# EAGLE design leslius (EAGLE 8.5.1)
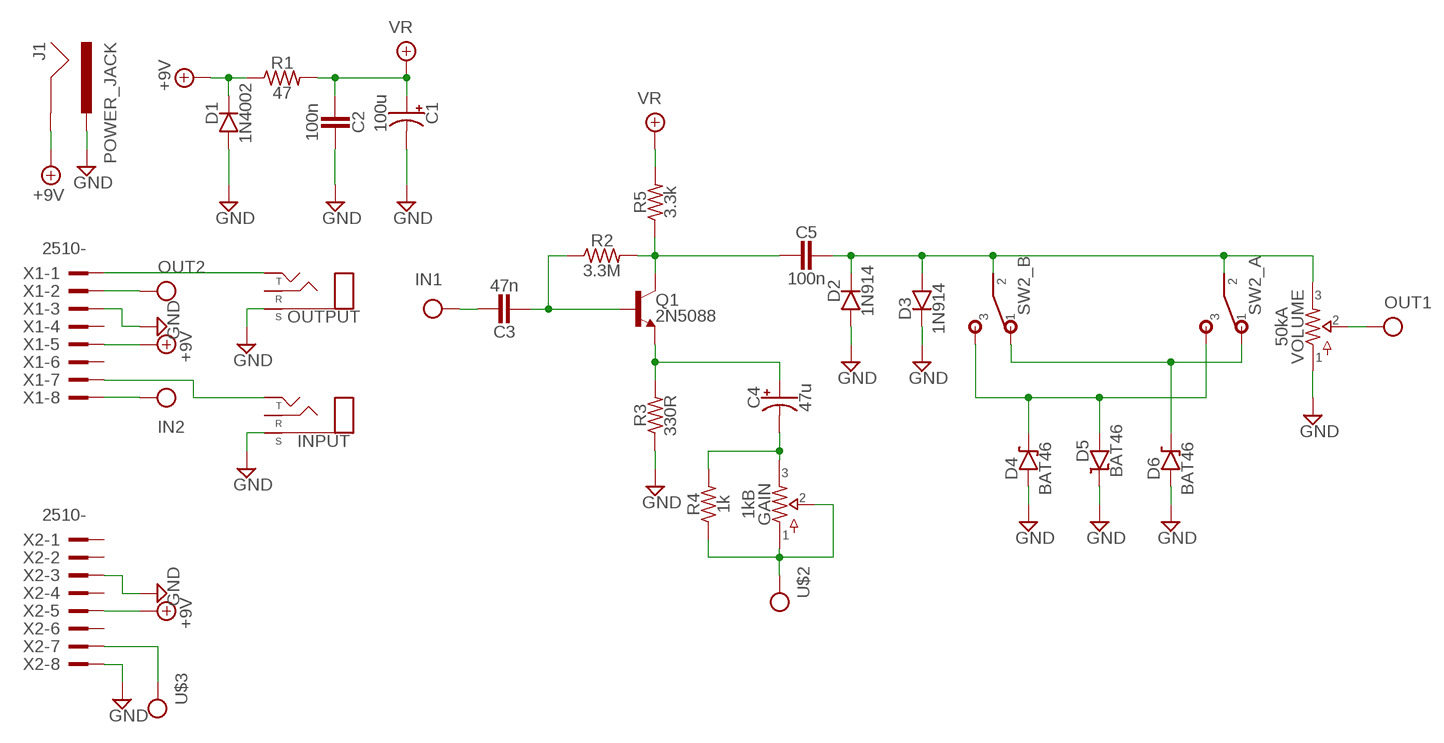
[diagram p0: schematic, sheet 1]

## Parts
C1  100u  0400  [040_020]
C2  100n  CER/FILM2  [050X030_025_2]
C3  47n  CER/FILMBOX.1  [BOX_SMALL]
C4  47u  0400  [040_020]
C5  100n  CER/FILMBOX.1  [BOX_SMALL]
D1  1N4002  DO41.2  [DO41-2]
D2  1N914  DO35.2  [DO35-2]
D3  1N914  DO35.2  [DO35-2]
D4  BAT46  ZENER.2  [DO41-2]
D5  BAT46  ZENER.2  [DO41-2]
D6  BAT46  ZENER.2  [DO41-2]
GAIN  1kB  POTS16MM  [16MM]
INPUT  STEREONMJ  [NMJ6HCD2]
J1  POWER_JACK  [POWER_JACK_PTH]
OUTPUT  STEREONMJ  [NMJ6HCD2]
Q1  2N5088  [TO92-]
R1  47  R_.3B  [R0207/3]
R2  3.3M  R_.3B  [R0207/3]
R3  330R  R_.3B  [R0207/3]
R4  1k  R_.3B  [R0207/3]
R5  3.3k  R_.3B  [R0207/3]
SW2  DPDT  [DPDT]
VOLUME  50kA  POTS16MM  [16MM]
X1  2510-  [PAK100/2500-10]
X2  2510-  [PAK100/2500-10]

## Nets
+9V: D1.C J1.GND R1.1 X1.5 X2.5
GND: C1.- C2.1 D1.A D2.A D3.C D4.A D5.C D6.A INPUT.S J1.PWR OUTPUT.S R3.1 VOLUME.1 X1.3 X2.3 X2.8
IN: C3.1 X1.8
N$1: C3.2 Q1.2(B) R2.1
N$2: INPUT.T X1.7
N$3: C5.1 Q1.1(C) R2.2 R5.1
N$4: OUTPUT.T X1.1
N$5: C4.+ Q1.3(E) R3.2
N$6: C4.- GAIN.3 R4.2
N$7: D6.C SW2.A1 SW2.B1
N$9: D4.C D5.A SW2.A3 SW2.B3
N$10: C5.2 D2.C D3.A SW2.A2 SW2.B2 VOLUME.3
OUT: VOLUME.2 X1.2
SND: GAIN.1 GAIN.2 R4.1 X2.7
VR: C1.+ C2.2 R1.2 R5.2
Unconnected: INPUT.R OUTPUT.R X1.4 X1.6 X2.1 X2.2 X2.4 X2.6

## Library data of the parts
C1 C4 = pedals-capacitors-elec:040
C2 C3 C5 = pedals-capacitors-film:CER/FILM: 47 - 120pF Xicon Ceramic Disc 2.5mm lead spacing
D1 = pedals-diodes:DO41: DO-41 Package Diodes: 1N4001 - 1N40019 Zener Diodes: 1N4728 - 1N4764
D2 D3 = pedals-diodes:DO35: DO-35 Package Diodes: 1N914
D4-D6 = pedals-diodes:ZENER
GAIN VOLUME = pedals-potentiometers:POTS
INPUT OUTPUT = pedals-jacks:STEREO
J1 = pedals-jacks:POWER_JACK: Power Jack Connector This is the standard 5.5mm barrel jack for power. The PTH is the most common, proven, reliable, footprint. The Slot footprint only works if the mill layer is transmitted to the PCB fab house so be warned. Here are the connectors we sell at SparkFun: DC Barrel Power Jack/Connector <https://www.sparkfun.com/products/119> (PRT-00119) DC Barrel Power Jack/Connector (SMD) <https://www.sparkfun.com/products/12748> (PRT-12748) DC Barrel Jack Adapter - Breadboard Compatible <https://www.sparkfun.com/products/10811> (PRT-10811) It is used on this SparkFun product (and many, many others): SparkFun RedBoard - Programmed with Arduino <https://www.sparkfun.com/products/12757> (DEV-12757) Also, if you need a mating power supply or connector, please check these out: Wall Adapter Power Supply - 9VDC 650mA <https://www.sparkfun.com/products/298> (TOL-00298) DC Barrel Jack Adapter - Male <https://www.sparkfun.com/products/10287> (PRT-10287); PROD_ID: CONN-08197
Q1 = pedals-transistors:2N5088: NPN Transistor
R1-R5 = pedals-resistors:R_
SW2 = pedals-switches:DPDT
X1 X2 = pedals-headers:2510-: 3M (TM) Pak 100 4-Wall Header Source: 3M; MF: 3M; MPN: 2510-6002UB; OC_FARNELL: 9838244; OC_NEWARK: 46F4725

## Board
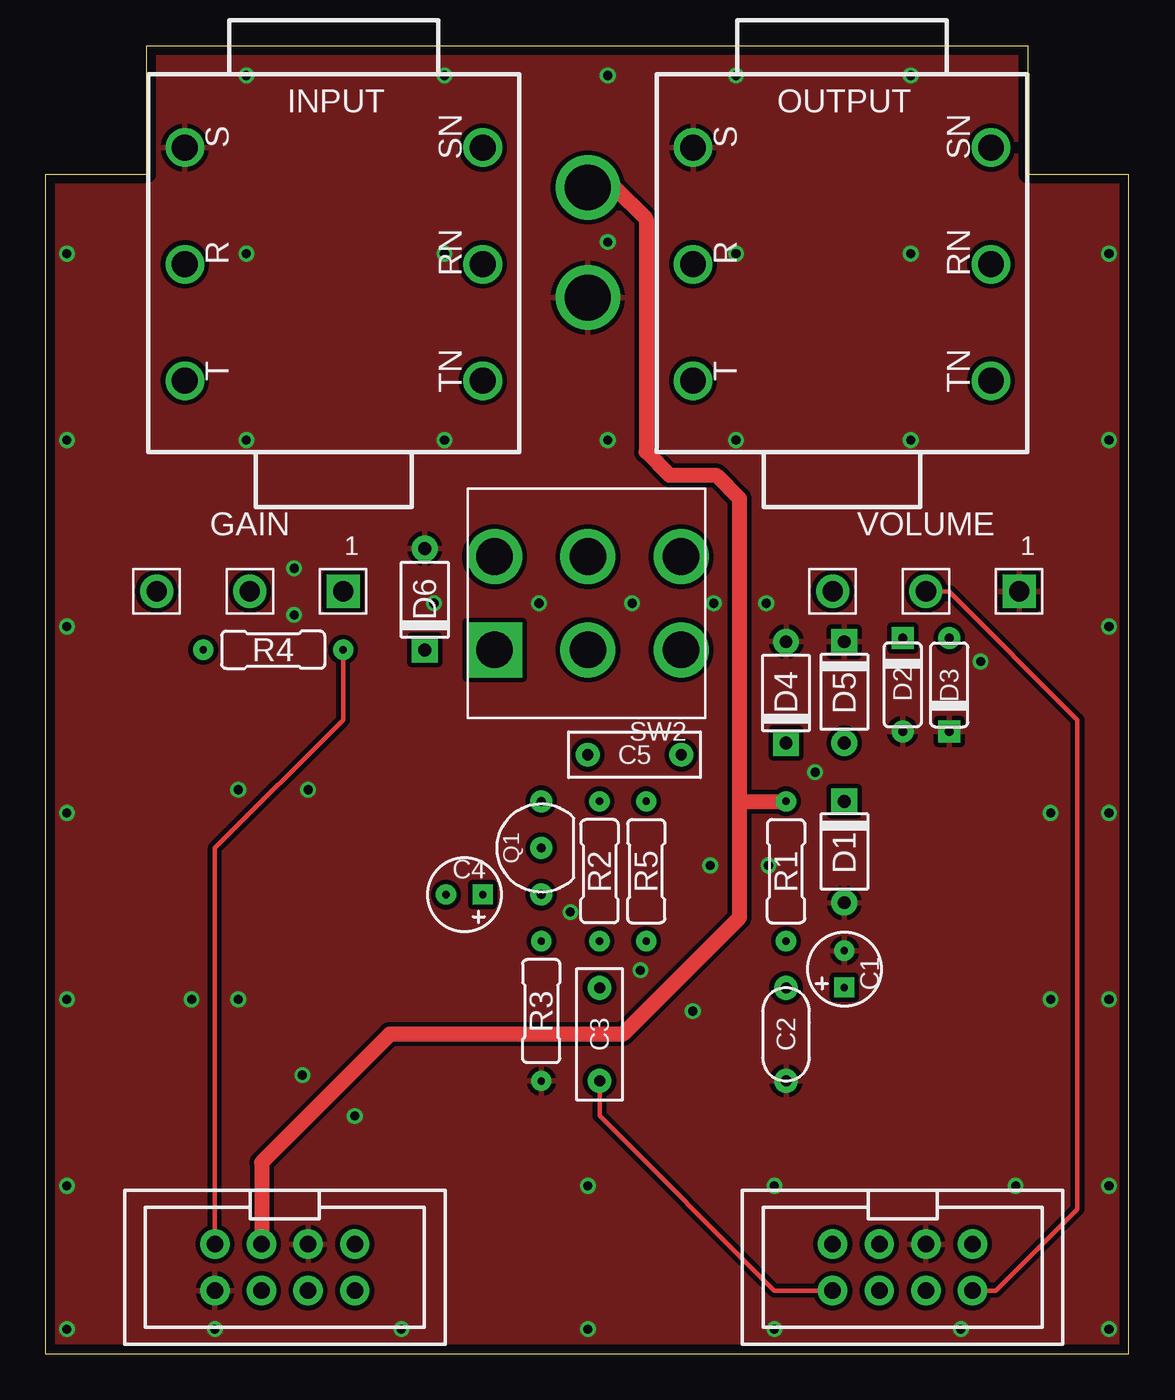
[diagram p1: board, top side]
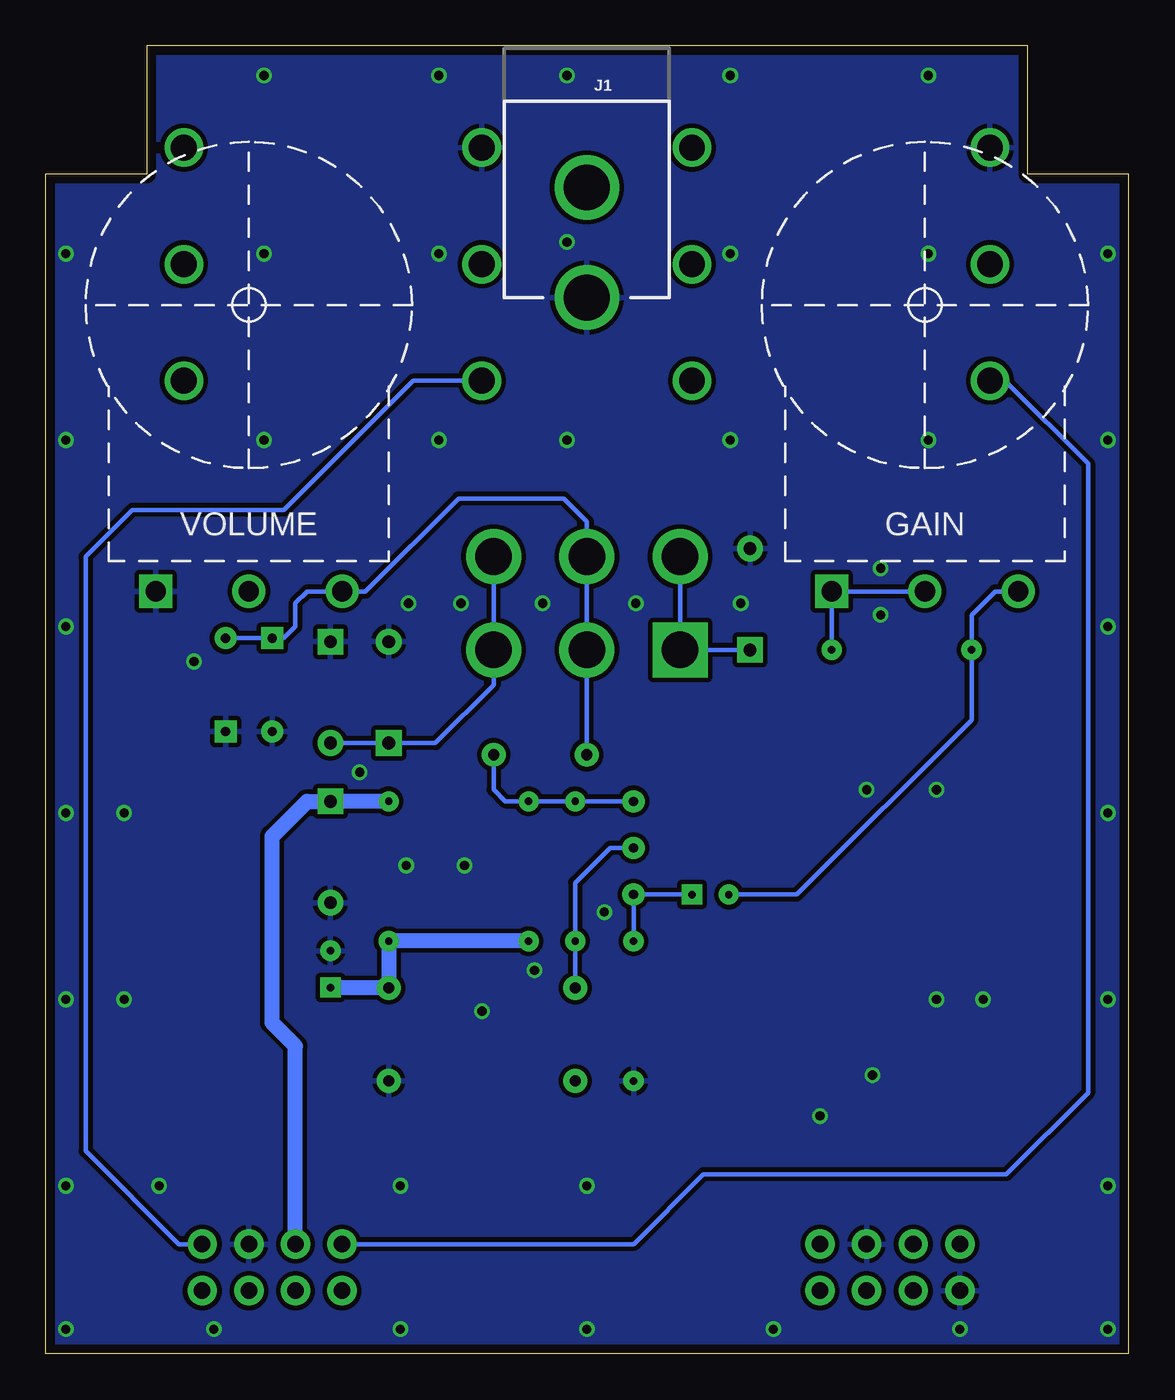
[diagram p2: board, bottom side, seen from below]

Size 59 x 71.27 mm. Coordinates in mm from the lower left corner, seen from the top.
Copper layers (1*16): Top 0.035mm / dielectric 1.6mm / Bottom 0.035mm
Design rules "Elecrow_2-layer_PCB_eagle_rule": minimum track width 6mil, minimum drill 12mil, track to track 6mil, track to pad 6mil, pad to pad 6mil, via to via 8mil, smd to smd 0mil, copper to edge 20mil, drill to drill 10mil, minimum pad ring 6mil, minimum via ring 6mil, stop-mask expansion 0mil, vias tented up to drill 100mil, thermal gap 10mil

### Footprints (pad centres in the part's own frame; a part is rotated, then mirrored left to right if it is on the bottom)
040_020 = drill 0.4 pad 1.1 square: + -1.001,0 | drill 0.4 pad 1.1: - 1.001,0
050X030_025_2 = drill 0.6 pad 1.3: 1 -2.54,0; 2 2.54,0
BOX_SMALL = drill 0.6 pad 1.3: 1 -2.54,0; 2 2.54,0
DO41-2 = drill 0.7 pad 1.4: A 2.794,0 | drill 0.7 pad 1.4 square: C -2.731,0
DO35-2 = drill 0.5 pad 1.2: A 2.54,0 | drill 0.5 pad 1.2 square: C -2.54,0
16MM = drill 1.1 pad 1.8 square: 1 5.08,-1 | drill 1.1 pad 1.8: 2 0,-1; 3 -5.08,-1
NMJ6HCD2 = drill 1.4: R 0,8.115; RN 0,-8.115; S 6.35,8.115; SN 6.35,-8.115; T -6.35,8.115; TN -6.35,-8.115
POWER_JACK_PTH = drill 2.5: GND 0,7.7; PWR 0,13.7
TO92- = drill 0.5 pad 1.2: 1 2.54,0; 2 0,0; 3 -2.54,0
R0207/3 = drill 0.4 pad 1.1: 1 -3.81,0; 2 3.81,0
DPDT = drill 2 pad 2.7 square: A1 -2.54,5.08 | drill 2 pad 2.7: A2 -2.54,0; A3 -2.54,-5.08; B1 2.54,5.08; B2 2.54,0; B3 2.54,-5.08
PAK100/2500-10 = drill 0.9 pad 1.6: 1 -3.81,-1.27; 2 -3.81,1.27; 3 -1.27,-1.27; 4 -1.27,1.27; 5 1.27,-1.27; 6 1.27,1.27; 7 3.81,-1.27; 8 3.81,1.27

### Placement (x,y rotation side)
C1  43.5,20.96 90 top
C2  40.32,17.4 90 top
C3  30.16,17.4 90 top
C4  22.8,25.02 180 top
C5  32.07,32.64 180 top
D1  43.5,27.37 270 top
D2  46.67,36.45 270 top
D3  49.21,36.45 90 top
D4  40.32,36 90 top
D5  43.5,36.07 270 top
D6  20.64,41.08 90 top
GAIN  11.11,42.55 0 top
INPUT  15.68,59.37 90 top
J1  29.53,71.25 180 bottom
OUTPUT  43.37,59.37 90 top
Q1  26.99,27.56 90 top
R1  40.32,26.29 270 top
R2  30.16,26.29 90 top
R3  26.99,18.67 90 top
R4  12.38,38.35 180 top
R5  32.7,26.29 270 top
SW2  29.53,40.89 90 top
U$1  [125B_PCB]  0,1.27 0 top
VOLUME  47.94,42.55 0 top
X1  46.67,4.7 180 top
X2  13.02,4.7 180 top

### Tracks (layer width: path | path; a pad name or v marks a point on that pad's centre or on a via)
+9V
  Top 0.813: J1.GND 31,63.55 32.7,61.85 32.7,49.15 33.97,47.88 36.51,47.88 37.78,46.61 37.78,30.1 | 37.78,30.1 R1.1 | 37.78,30.1 37.78,23.75 31.43,17.4 18.73,17.4 11.75,10.41 X2.5
  Bottom 0.813: R1.1 D1.C 44.77,30.1 46.67,28.19 46.67,18.03 45.4,16.76 X1.5
GND  (via drill 0.5 pad 0.85)
  other vias: 57.91,59.94 57.91,49.78 10.92,69.66 21.72,69.66 30.61,69.66 1.14,49.78 10.92,59.94 10.92,49.78 21.72,59.94 21.72,49.78 30.61,60.58 37.59,69.66 47.12,69.66 37.59,59.94 37.59,49.78 47.12,59.94 47.12,49.78 57.91,39.62 57.91,29.46 57.91,19.3 57.91,9.14 57.91,1.33 49.85,1.33 39.69,1.33 29.53,1.33 19.37,1.33 9.21,1.33 1.14,1.33 1.14,59.94 1.14,39.62 1.14,29.46 1.14,19.3 1.14,9.14 30.61,49.78 52.83,9.14 54.74,19.3 54.74,29.46 50.93,37.72 36.39,40.89 39.24,40.89 41.91,31.69 31.94,40.89 26.86,40.89 13.53,40.26 13.53,42.8 29.53,9.14 39.69,9.14 21.15,40.89 7.94,19.3 10.48,19.3 10.48,30.73 14.29,30.73 13.97,15.18 16.83,12.95 32.39,20.89 35.24,18.67 36.2,26.61 39.37,26.61 28.57,24.07
  pour Bottom (isolate 0.254): 0.32,70.74 58.74,70.74 58.74,-1.02 0.32,-1.02
  pour Top (isolate 0.254): 59.37,0.25 59.37,71.37 -0.32,71.37 -0.32,-0.38 59.37,-0.38
IN
  Top 0.254: X1.8 39.69,3.43 30.16,12.95 C3.1
N$1
  Bottom 0.254: Q1.2 28.26,27.56 30.16,25.65 R2.1 C3.2
N$2
  Bottom 0.254: INPUT.T 7.51,52.96 6.67,52.96 2.22,48.51 2.22,14.22 6.67,9.78 23.18,9.78 26.99,5.97 X1.7
N$3
  Bottom 0.254: Q1.1 R2.2 R5.1 33.97,30.1 34.61,30.73 C5.1
N$4
  Bottom 0.254: OUTPUT.T 38.99,53.02 46.04,45.97 54.29,45.97 56.83,43.43 56.83,11.05 51.75,5.97 X1.1
N$5
  Bottom 0.254: R3.2 Q1.3 C4.+
N$6
  Bottom 0.254: C4.- 18.1,25.02 8.57,34.54 R4.2 8.57,40.26 7.29,41.55 GAIN.3
N$7
  Bottom 0.254: D6.C SW2.A1 SW2.B1
N$9
  Bottom 0.254: D5.A D4.C 37.78,33.27 34.61,36.45 SW2.A3 SW2.B3
N$10
  Bottom 0.254: C5.2 SW2.A2 SW2.B2 29.53,45.34 30.8,46.61 36.51,46.61 41.59,41.53 42.85,41.53 VOLUME.3 | VOLUME.3 43.48,41.55 | VOLUME.3 44.75,41.55 45.4,40.89 45.4,39.62 46.04,38.99 D2.C D3.A
OUT
  Top 0.254: VOLUME.2 47.96,41.53 49.21,41.53 56.2,34.54 56.2,7.87 51.75,3.43 X1.2
SND
  Top 0.254: X2.7 9.21,27.56 16.19,34.54 R4.1
  Bottom 0.254: GAIN.2 GAIN.1 R4.1
VR
  Bottom 0.813: R5.2 R1.2 C2.2 43.48,19.94 C1.+